# Altium schematic sheet RF_Gen.SchDoc: RF Generation & Regulation
size 279 x 215 mm; Engineer: Shaashwat Sahoo; Revision: V1.0; SheetNumber: 1; SheetTotal: 6; SPICEModelCacheMXYIGOMC: <root> / <DocumentId>MXYIGOMC</DocumentId> / <CacheFrame Number="0"> / <Model Name="cap" Kind="MDL"> / <Text>*Default semiconductor capacitor / .MODEL CAP C()</Text> / </Model> / </CacheFrame> / </root>
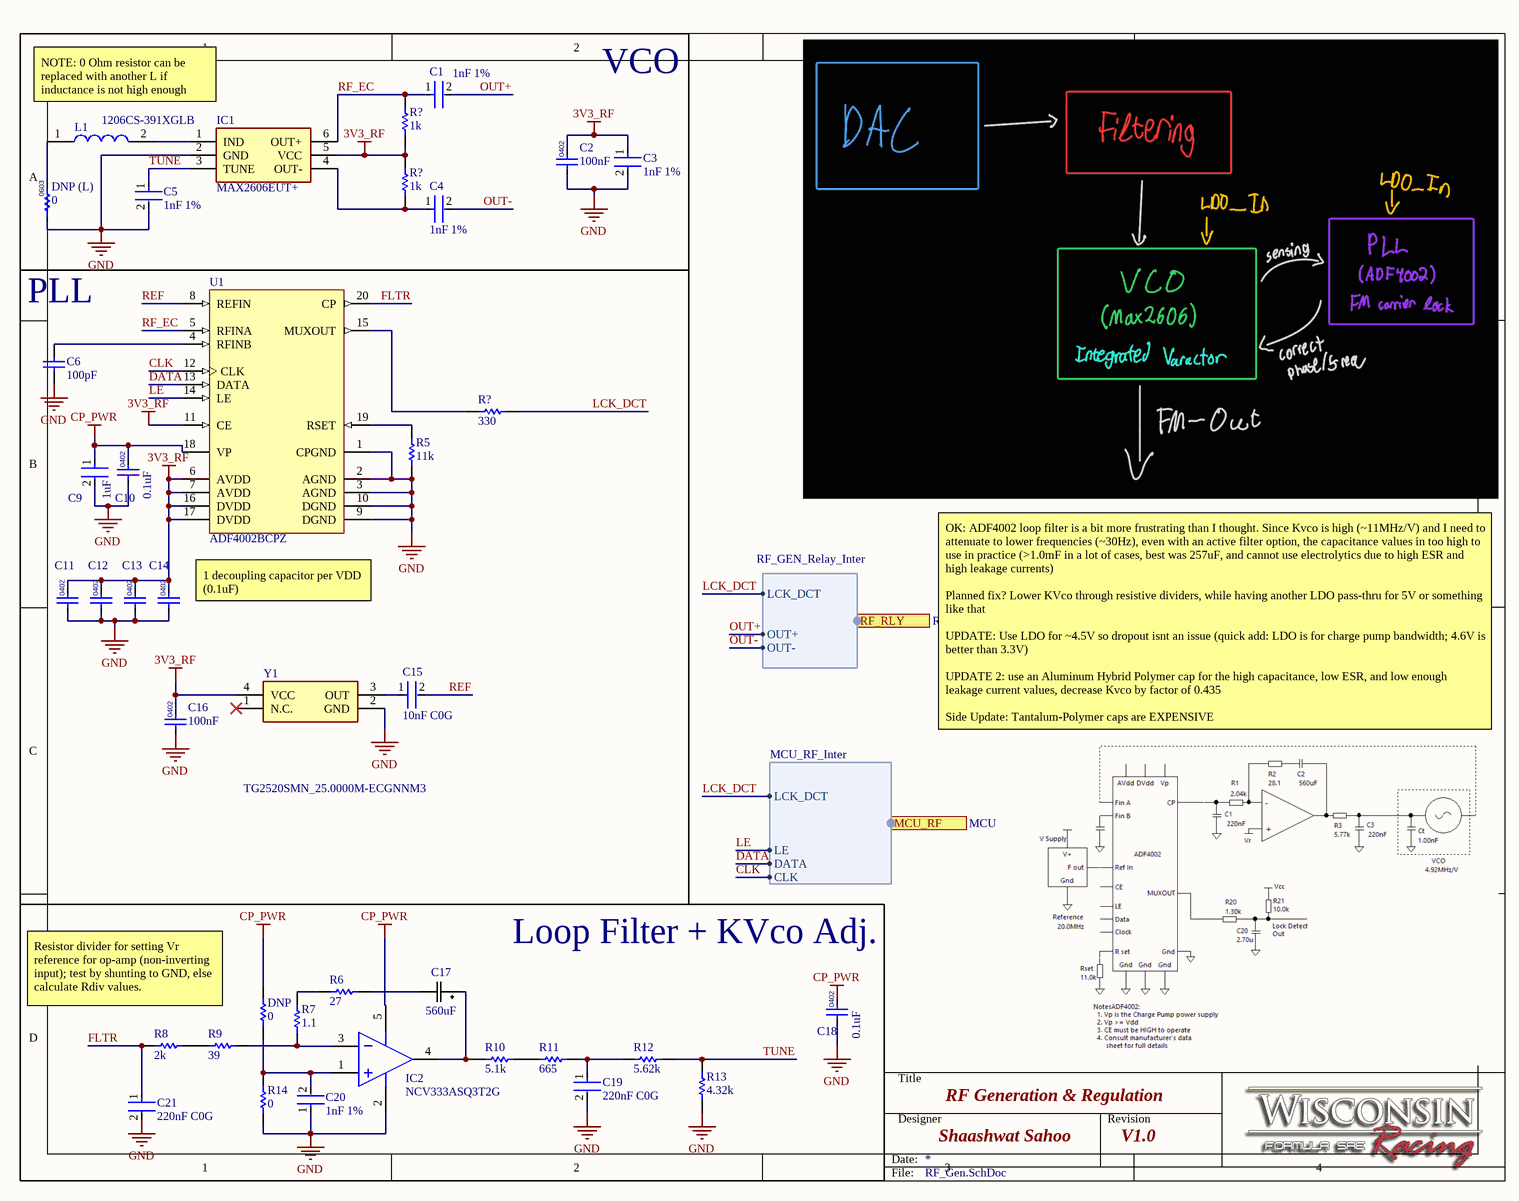
[diagram p0: RF_Gen.SchDoc]

## Parts
(Parts that share a designator on the sheet are numbered #1, #2 ... from top to bottom, then left to right.)
C1  1nF 1%  [FP-GRT155-0_05-IPC_A]
C2  100nF  [FP-CC0402-IPC_B]
C3  1nF 1%  [FP-GRT155-0_05-IPC_A]
C4  1nF 1%  [FP-GRT155-0_05-IPC_A]
C5  1nF 1%  [FP-GRT155-0_05-IPC_A]
C6  100pF  [CAPC1005X55X25ML05T10]
C9  1uF  [FP-GRM155-0_1-IPC_A]
C10  0.1uF  [FP-CC0402-IPC_B]
C11  0.1uF  [FP-CC0402-IPC_B]  (value not drawn)
C12  0.1uF  [FP-CC0402-IPC_B]  (value not drawn)
C13  0.1uF  [FP-CC0402-IPC_B]  (value not drawn)
C14  0.1uF  [FP-CC0402-IPC_B]  (value not drawn)
C15  10nF C0G  [FP-GRM155-0_15-MFG]
C16  100nF  [FP-CC0402-IPC_B]
C17  560uF  [CAP_GY_10X10_NCH]
C18  0.1uF  [FP-CC0402-IPC_B]
C19  220nF C0G  [FP-GRM31C-0_2-e0_3_0_8-IPC_B]
C20  1nF 1%  [FP-GRT155-0_05-IPC_A]
C21  220nF C0G  [FP-GRM31C-0_2-e0_3_0_8-IPC_B]
DNP  0  [RESC1005X40X25NL05T10]
DNP_(L)  0  [Res0603-type-2]
IC1  MAX2606EUT+  [SOT95P280X145-6N]
IC2  NCV333ASQ3T2G  [SOT65P210X110-5N]
L1  1206CS-391XGLB  [INDC3622X152N]
R5  11k  [RESC1005X40X25NL05T10]
R6  27  [RESC1005X40X25LL05T10]
R7  1.1  [RESC1005X40X25NL05T10]
R8  2k  [RESC1005X35X25NL10T10]
R9  39  [RESC1005X40X25LL05T10]
R10  5.1k  [RESC1005X40X25NL05T10]
R11  665  [RESC1005X40X25ML05T10]
R12  5.62k  [RESC1005X40X25LL05T10]
R13  4.32k  [RESC1005X40X25NL05T10]
R14  0  [RESC1005X40X25NL05T10]
R?#1  1k  [RESC1005X40X25LL05T10]
R?#2  1k  [RESC1005X40X25LL05T10]
R?#3  330  [RESC1005X40X25LL05T10]
U1  ADF4002BCPZ  [ADI-CP-20-1_M]
Y1  TG2520SMN_25.0000M-ECGNNM3  [TG2520SMN250000MECGNNM3]

## Blocks framed on the sheet
VCO: C1-C5 DNP_(L) IC1 L1 R?#1 R?#2
PLL: C6 C9-C16 R5 R?#3 U1 Y1
Loop Filter + KVco Adj.: C17-C21 DNP IC2 R6-R14

## Ports
MCU_RF (harness MCU_RF_Inter, see MCU), RF_RLY (harness RF_GEN_Relay_Inter, see RF_Bypass)

## Harnesses
MCU_RF_Inter: LCK_DCT, LE, DATA, CLK
RF_GEN_Relay_Inter: LCK_DCT, OUT+, OUT-

## Nets
3V3_RF: C2.2 C3.1 C11.2 C12.2 C13.2 C14.2 C16.2 IC1.5(VCC) R?#1.1 R?#2.2 U1.6(AVDD) U1.7(AVDD) U1.11(CE) U1.16(DVDD) U1.17(DVDD) Y1.4(VCC)
CP_PWR: C9.1 C10.2 C18.2 DNP.2 IC2.5(V-) U1.18(VP)
GND: C2.1 C3.2 C5.2 C6.2 C9.2 C10.1 C11.1 C12.1 C13.1 C14.1 C16.1 C18.1 C19.2 C20.1 C21.2 DNP_(L).1 IC1.2(GND) IC2.2(V-) R5.1 R13.1 R14.1 U1.1(CPGND) U1.2(AGND) U1.3(AGND) U1.9(DGND) U1.10(DGND) Y1.2(GND)
CLK: U1.12(CLK) ; port MCU_RF.CLK
DATA: U1.13(DATA) ; port MCU_RF.DATA
FLTR: C21.1 R8.1 U1.20(CP)
LCK_DCT: R?#3.2 ; port MCU_RF.LCK_DCT, port RF_RLY.LCK_DCT
LE: U1.14(LE) ; port MCU_RF.LE
OUT+: C1.2 ; port RF_RLY.OUT+
OUT-: C4.2 ; port RF_RLY.OUT-
REF: C15.2 U1.8(REFIN)
RF_EC: C1.1 IC1.6(OUT+) R?#1.2 U1.5(RFINA)
TUNE: C5.1 IC1.3(TUNE) R12.2 R13.2
NetC4_1: C4.1 IC1.4(OUT-) R?#2.1
NetC6_1: C6.1 U1.4(RFINB)
NetC15_1: C15.1 Y1.3(OUT)
NetC17_1: C17.1 IC2.4(OUT) R10.1
NetC17_2: C17.2 R6.2
NetC19_1: C19.1 R11.2 R12.1
NetC20_2: C20.2 DNP.1 IC2.1(IN+) R14.2
NetDNP_(L)_2: DNP_(L).2 L1.1
NetIC1_1: IC1.1(IND) L1.2
NetIC2_3: IC2.3(IN-) R7.1 R9.2
NetR5_2: R5.2 U1.19(RSET)
NetR6_1: R6.1 R7.2
NetR8_2: R8.2 R9.1
NetR10_2: R10.2 R11.1
NetR?#3_1: R?#3.1 U1.15(MUXOUT)

Not connected (* = marked no-connect by the designer): Y1 1(N.C.)*

## Notes on the sheet
- NOTE: 0 Ohm resistor can be replaced with another L if inductance is not high enough
- 1 decoupling capacitor per VDD (0.1uF)
- OK: ADF4002 loop filter is a bit more frustrating than I thought. Since Kvco is high (~11MHz/V) and I need to attenuate to lower frequencies (~30Hz), even with an active filter option, the capacitance values in too high to use in practice (>1.0mF in a lot of cases, best was 257uF, and cannot use electrolytics due to high ESR and high leakage currents)
  Planned fix? Lower KVco through resistive dividers, while having another LDO pass-thru for 5V or something like that
  UPDATE: Use LDO for ~4.5V so dropout isnt an issue (quick add: LDO is for charge pump bandwidth; 4.6V is better than 3.3V)
  UPDATE 2: use an Aluminum Hybrid Polymer cap for the high capacitance, low ESR, and low enough leakage current values, decrease Kvco by factor of 0.435
  Side Update: Tantalum-Polymer caps are EXPENSIVE
- Resistor divider for setting Vr reference for op-amp (non-inverting input); test by shunting to GND, else calculate Rdiv values.
- Title
- Designer
- Revision
- Date:
- File:
- (in symbol CMP-Cap-00006-1) 0402
- (in symbol CMP-Res-00022-2) 0603

## Library data of the parts
C1 C3-C5 C20 = CMP-06035-012909-1: Multi-Layer Ceramic Capacitor 1nF 50V C0G ±1% 0402 Paper T/R / GRT1555C1H102FA02D
C2 C16 = CMP-Cap-00006-1: Ceramic Capacitor, Multilayer, Ceramic, 16V, 10% +Tol, 10% -Tol, X7R, 15% TC, 0.1uF, Surface Mount, 0402; Dielectric: XR7; Tolerance: 10%; Capacitance: 100nF; Voltage Rating: 16V
C6 = CMP-2008-03915-1: Manufacturer: Murata; Part Number: GRM1555C1H101JA01D
C9 = CMP-06035-012596-1: Chip Multilayer Ceramic Capacitors for General Purpose, 0402, 1.0uF, X7R, 15%, 10%, 10V
C10-C14 C18 = CMP-Cap-00006-1: Ceramic Capacitor, Multilayer, Ceramic, 16V, 10% +Tol, 10% -Tol, X7R, 15% TC, 0.1uF, Surface Mount, 0402; Dielectric: XR7; Capacitance: 100nF; Tolerance: 10%; Voltage Rating: 16V
C15 = CMP-06035-053372-1: Chip Multilayer Ceramic Capacitors for General Purpose, 0402, 10000pF, C0G, 30ppm/°C, 5%, 35V
C17 = CMP-034-000012-1: Description; Manufacturer_Name: Nichicon; Copyright: Copyright (C) 2025 Ultra Librarian. All rights reserved.; Design Item ID: GYB1J560MCQ1GS; Manufacturer_Part_Number: GYB1J560MCQ1GS; Source: GYB1J560MCQ1GS.SchLib
C19 C21 = CMP-06035-005862-1: Chip Multilayer Ceramic Capacitors for General Purpose, 1206, 0.22uF, C0G, 30ppm/°C, 5%, 25V
DNP R14 = CMP-1011-00001-2: Manufacturer: Yageo / Phycomp; Part Number: RC0402JR-070RL
DNP_(L) = CMP-Res-00022-2: Fixed Resistor, Metal Glaze/thick Film, 0.1W, 0ohm, Surface Mount, 0603; Tolerance: 0.1%; Power: 100mW; Resistance: 0
IC1 = MAX2606EUT+: Integrated Circuit; Manufacturer_Name: Analog Devices; Datasheet Link: https://datasheets.maximintegrated.com/en/ds/MAX2605-MAX2609.pdf; Height: 1.45mm; Manufacturer_Part_Number: MAX2606EUT+; Mouser Part Number: 700-MAX2606EUT+; Mouser Price/Stock: https://www.mouser.co.uk/ProductDetail/Analog-Devices-Maxim-Integrated/MAX2606EUT%2b?qs=U8%2FOE6X5Fv%2F2oJ3nHVn6vA%3D%3D
IC2 = CMP-006-000098-2: Low Offset Voltage: 10 V max (NCS333); Manufacturer_Name: onsemi; Design Item ID: NCV333ASQ3T2G; Manufacturer_Part_Number: NCV333ASQ3T2G; Source: SamacSys.SchLib; Datasheet Link: https://www.onsemi.com/pub/Collateral/NCS333-D.PDF; Height: 1.1mm; Arrow Part Number: NCV333ASQ3T2G; Arrow Price/Stock: https://www.arrow.com/en/products/ncv333asq3t2g/on-semiconductor?region=nac; Mouser Part Number: 863-NCV333ASQ3T2G; Mouser Price/Stock: https://www.mouser.co.uk/ProductDetail/onsemi/NCV333ASQ3T2G?qs=f9yNj16SXrKU9Ty3EUv2qA%3D%3D
L1 = 1206CS-391XGLB: Inductor; Manufacturer_Name: COILCRAFT; Datasheet Link: https://componentsearchengine.com/Datasheets/2/1206CS-391XGLB.pdf; Height: 1.52mm; Manufacturer_Part_Number: 1206CS-391XGLB
R5 R10 = CMP-2002-07753-1: Part Number: RC0402FR-075K1L; Manufacturer: Yageo / Phycomp
R6 = CMP-2002-07055-1: Part Number: RC0402FR-0727RL; Manufacturer: Yageo / Phycomp
R7 = CMP-1011-00175-2: Part Number: RC0402FR-071R1L; Manufacturer: Yageo / Phycomp
R8 = CMP-2002-02941-1: Manufacturer: Yageo; Part Number: RT0402BRD072KL
R9 = CMP-1011-00350-2: Manufacturer: Yageo / Phycomp; Part Number: RC0402FR-0739RL
R11 = CMP-2002-07113-1: Part Number: RC0402FR-07665RL; Manufacturer: Yageo / Phycomp
R12 = CMP-2002-07755-1: Part Number: RC0402FR-075K62L; Manufacturer: Yageo / Phycomp
R13 = CMP-1011-00582-2: Part Number: RC0402FR-074K32L; Manufacturer: Yageo / Phycomp
R?#1 R?#2 = CMP-2002-07941-1: Part Number: RC0402JR-071KL; Manufacturer: Yageo / Phycomp
R?#3 = CMP-2002-07613-1: Part Number: RC0402FR-07330RL; Manufacturer: Yageo / Phycomp
U1 = CMP-0287-00012-1: Phase Detector/Frequency Synthesizer, CP-20-1, Pb-Free, 490 Tray; Max REFin (MHz): 300MHz; Supply Current: 5mA; Norm Phase Noise (dBc/Hz): -222dBc; Max RF Input (MHz): 400MHz; Frequency Range: 5MHz-400MHz; Single/Dual: Single; PackageReference: CP-20-1; Code_JEDEC: MO-220-VGGD-1; ComponentLink1URL: www.analog.com; ComponentLink3Description: Package Specification; PackageVersion: 012508-B; DatasheetVersion: Rev. B; ComponentLink3URL: http://www.analog.com/static/imported-files/packages/PKG_PDF/LFCSP(CP)/CP_20_1.pdf; ComponentLink2Description: Datasheet; ComponentLink1Description: Manufacturer URL; PackageDescription: 20-Lead Lead Frame Chip Scale Package [LFCSP_VQ]; ComponentLink2URL: http://www.analog.com/static/imported-files/data_sheets/ADF4002.pdf
Y1 = TG2520SMN_25.0000M-ECGNNM3: Crystal or Oscillator; Manufacturer_Name: Epson Timing; Manufacturer_Part_Number: TG2520SMN 25.0000M-ECGNNM3; Datasheet Link: https://au.mouser.com/datasheet/2/137/Epson_TG2016SMN_en_1649545-1889946.pdf; Height: 0.8mm; Mouser Part Number: 732-TG252S25ECGNNM3; Mouser Price/Stock: https://www.mouser.co.uk/ProductDetail/Epson-Timing/TG2520SMN-25.0000M-ECGNNM3?qs=d0WKAl%252BL4KZiXJ1i3MlmDQ%3D%3D